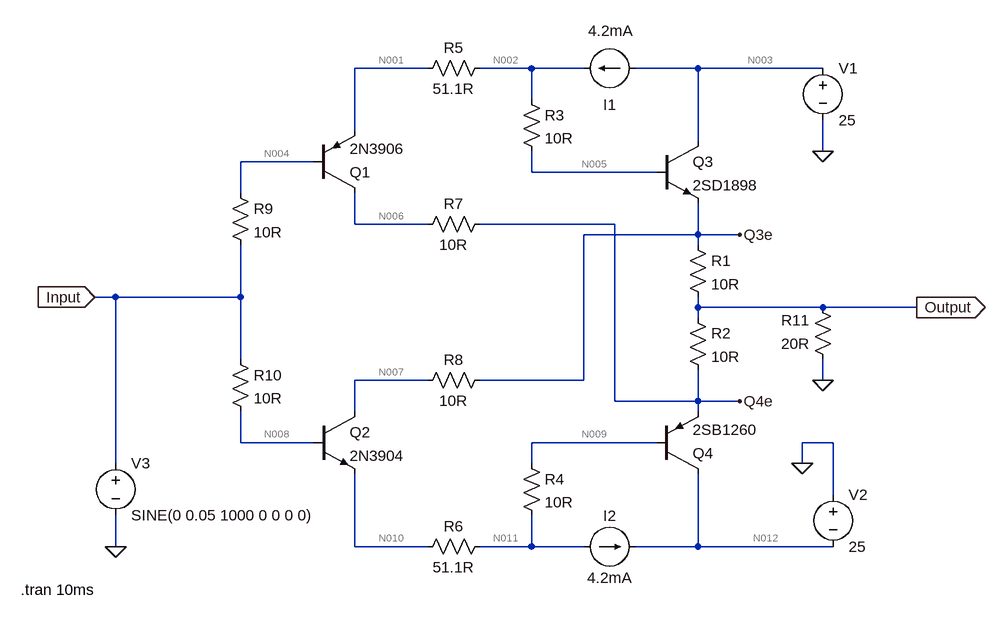
[diagram p0: schematic KC_Buffer_Spice.asc]
KC_Buffer_Spice.asc, the LTspice schematic file:
Version 4
SHEET 1 1208 680
WIRE 320 -320 208 -320
WIRE 480 -320 400 -320
WIRE 560 -320 480 -320
WIRE 736 -320 640 -320
WIRE 928 -320 736 -320
WIRE 480 -272 480 -320
WIRE 208 -224 208 -320
WIRE 736 -208 736 -320
WIRE 928 -192 928 -240
WIRE 144 -176 32 -176
WIRE 480 -160 480 -192
WIRE 672 -160 480 -160
WIRE 32 -128 32 -176
WIRE 208 -80 208 -128
WIRE 320 -80 208 -80
WIRE 608 -80 400 -80
WIRE 736 -64 736 -112
WIRE 736 -64 560 -64
WIRE 800 -64 736 -64
WIRE 736 -48 736 -64
WIRE -160 32 -192 32
WIRE 32 32 32 -48
WIRE 32 32 -160 32
WIRE 736 48 736 32
WIRE 928 48 736 48
WIRE 1072 48 928 48
WIRE 736 64 736 48
WIRE 32 128 32 32
WIRE 320 160 208 160
WIRE 560 160 560 -64
WIRE 560 160 400 160
WIRE 928 160 928 128
WIRE 608 192 608 -80
WIRE 736 192 736 144
WIRE 736 192 608 192
WIRE 800 192 736 192
WIRE 208 208 208 160
WIRE 736 208 736 192
WIRE 32 256 32 208
WIRE 144 256 32 256
WIRE 672 256 480 256
WIRE 944 256 896 256
WIRE -160 288 -160 32
WIRE 480 288 480 256
WIRE 896 288 896 256
WIRE 944 336 944 256
WIRE -160 416 -160 368
WIRE 208 416 208 304
WIRE 320 416 208 416
WIRE 480 416 480 368
WIRE 480 416 400 416
WIRE 560 416 480 416
WIRE 736 416 736 304
WIRE 736 416 640 416
WIRE 944 416 736 416
FLAG -192 32 Input
IOPIN -192 32 In
FLAG 1072 48 Output
IOPIN 1072 48 Out
FLAG 928 -192 0
FLAG 896 288 0
FLAG -160 416 0
FLAG 928 160 0
FLAG 800 -64 Q3e
FLAG 800 192 Q4e
SYMBOL npn 144 208 R0
SYMATTR InstName Q2
SYMATTR Value 2N3904
SYMBOL npn 672 -208 R0
SYMATTR InstName Q3
SYMATTR Value 2SD1898
SYMBOL pnp 144 -128 M180
SYMATTR InstName Q1
SYMATTR Value 2N3906
SYMBOL pnp 672 304 M180
SYMATTR InstName Q4
SYMATTR Value 2SB1260
SYMBOL res 720 -64 R0
SYMATTR InstName R1
SYMATTR Value 10R
SYMBOL res 720 48 R0
SYMATTR InstName R2
SYMATTR Value 10R
SYMBOL current 640 -320 R90
WINDOW 0 56 30 VRight 2
WINDOW 3 -73 38 VTop 2
WINDOW 123 0 0 Left 0
WINDOW 39 0 0 Left 0
SYMATTR InstName I1
SYMATTR Value 4.2mA
SYMBOL current 560 416 R270
WINDOW 0 32 40 VTop 2
WINDOW 3 -32 40 VBottom 2
WINDOW 123 0 0 Left 0
WINDOW 39 0 0 Left 0
SYMATTR InstName I2
SYMATTR Value 4.2mA
SYMBOL res 464 -288 R0
SYMATTR InstName R3
SYMATTR Value 10R
SYMBOL res 464 272 R0
SYMATTR InstName R4
SYMATTR Value 10R
SYMBOL res 416 -336 R90
WINDOW 0 0 56 VBottom 2
WINDOW 3 32 56 VTop 2
SYMATTR InstName R5
SYMATTR Value 51.1R
SYMBOL res 416 400 R90
WINDOW 0 0 56 VBottom 2
WINDOW 3 32 56 VTop 2
SYMATTR InstName R6
SYMATTR Value 51.1R
SYMBOL res 416 -96 R90
WINDOW 0 0 56 VBottom 2
WINDOW 3 32 56 VTop 2
SYMATTR InstName R7
SYMATTR Value 10R
SYMBOL res 416 144 R90
WINDOW 0 0 56 VBottom 2
WINDOW 3 32 56 VTop 2
SYMATTR InstName R8
SYMATTR Value 10R
SYMBOL res 16 -144 R0
SYMATTR InstName R9
SYMATTR Value 10R
SYMBOL res 16 112 R0
SYMATTR InstName R10
SYMATTR Value 10R
SYMBOL voltage 928 -336 R0
WINDOW 123 0 0 Left 0
WINDOW 39 0 0 Left 0
SYMATTR InstName V1
SYMATTR Value 25
SYMBOL voltage 944 320 R0
WINDOW 123 0 0 Left 0
WINDOW 39 0 0 Left 0
SYMATTR InstName V2
SYMATTR Value 25
SYMBOL voltage -160 272 R0
WINDOW 123 0 0 Left 0
WINDOW 39 0 0 Left 0
SYMATTR InstName V3
SYMATTR Value SINE(0 0.05 1000 0 0 0 0)
SYMBOL res 944 144 R180
WINDOW 0 36 76 Left 2
WINDOW 3 36 40 Left 2
SYMATTR InstName R11
SYMATTR Value 20R
TEXT -306 482 Left 2 !.tran 10ms

The netlist it stands for:
* KC_Buffer_Spice.asc
Q2 N007 N008 N010 0 2N3904
Q3 N003 N005 Q3e 0 2SD1898
Q1 N006 N004 N001 0 2N3906
Q4 N012 N009 Q4e 0 2SB1260
R1 Q3e Output 10R
R2 Output Q4e 10R
I1 N003 N002 4.2mA
I2 N011 N012 4.2mA
R3 N002 N005 10R
R4 N009 N011 10R
R5 N002 N001 51.1R
R6 N011 N010 51.1R
R7 Q4e N006 10R
R8 Q3e N007 10R
R9 N004 Input 10R
R10 Input N008 10R
V1 N003 0 25
V2 0 N012 25
V3 Input 0 SINE(0 0.05 1000 0 0 0 0)
R11 0 Output 20R
.model NPN NPN
.model PNP PNP
.lib standard.bjt
.tran 10ms
.backanno
.end

* Results of the author's LTspice run, read from the files saved beside the schematic
* Operating Point, zero values left out:
*   V(n007) = 214.8 mV
*   V(n008) = -137.1 µV
*   V(n010) = -692.5 mV
*   V(n003) = 25 V
*   V(n005) = 901.6 mV
*   V(q3e) = 255.6 mV
*   V(n006) = -213.9 mV
*   V(n004) = 205.9 µV
*   V(n001) = 692.7 mV
*   V(n012) = -25 V
*   V(n009) = -900.8 mV
*   V(q4e) = -254.8 mV
*   V(output) = 331 µV
*   V(n002) = 902.5 mV
*   V(n011) = -901.8 mV
*   Ic(Q4) = -29.49 mA
*   Ib(Q4) = -104.6 µA
*   Ie(Q4) = 29.59 mA
*   Ic(Q1) = -4.084 mA
*   Ib(Q1) = -20.59 µA
*   Ie(Q1) = 4.105 mA
*   Ic(Q3) = 29.51 mA
*   Ib(Q3) = 95.1 µA
*   Ie(Q3) = -29.61 mA
*   Ic(Q2) = 4.082 mA
*   Ib(Q2) = 13.71 µA
*   Ie(Q2) = -4.095 mA
*   I(I2) = 4.2 mA
*   I(I1) = 4.2 mA
*   I(R11) = -16.55 µA
*   I(R10) = 13.71 µA
*   I(R9) = 20.59 µA
*   I(R8) = 4.082 mA
*   I(R7) = -4.084 mA
*   I(R6) = -4.095 mA
*   I(R5) = 4.105 mA
*   I(R4) = 104.6 µA
*   I(R3) = 95.1 µA
*   I(R2) = 25.51 mA
*   I(R1) = 25.53 mA
*   I(V3) = 6.871 µA
*   I(V2) = -33.69 mA
*   I(V1) = -33.71 mA
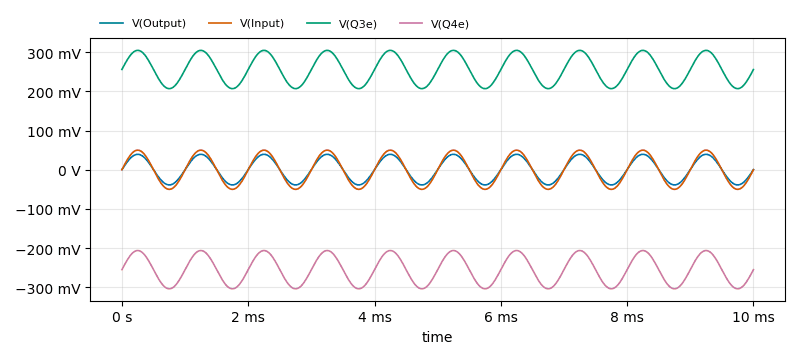
[diagram p1: Transient Analysis of KC_Buffer_Spice.asc, plotted from the saved traces]
* Transient Analysis, 1 run:
*   V(Output): min -38.7 mV, max 39.36 mV, average 331 µV, rms 27.6 mV, last 330.4 µV
*   V(Input): min -49.95 mV, max 49.95 mV, average 0 V, rms 35.32 mV, last 0 V
*   V(Q3e): min 206.8 mV, max 304.4 mV, average 255.6 mV, rms 257.9 mV, last 255.6 mV
*   V(Q4e): min -303.6 mV, max -206 mV, average -254.8 mV, rms 257.1 mV, last -254.8 mV